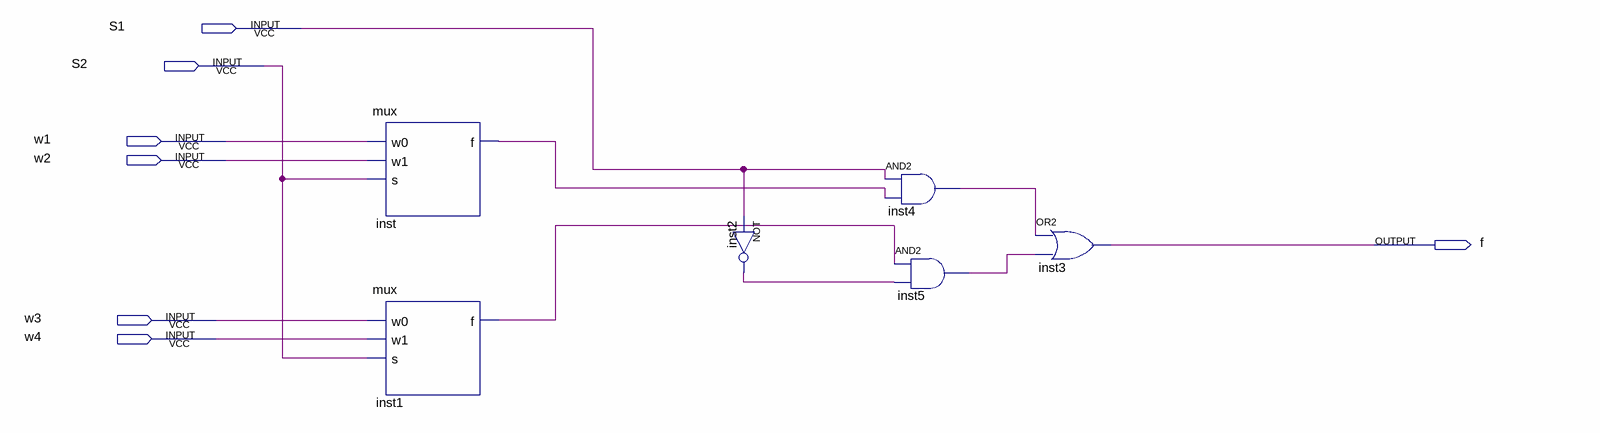
[diagram p0: schematic sheet]
// Quartus schematic muxModified.bdf as structural Verilog: 6 symbols, 7 pins
module muxModified (
  input  S1,
  input  S2,
  input  w1,
  input  w2,
  input  w3,
  input  w4,
  output f
);

  wire inst1_f, inst2_out, inst4_out, inst5_out, inst_f;

  mux inst (.w0(w1), .w1(w2), .s(S2), .f(inst_f));
  mux inst1 (.w0(w3), .w1(w4), .s(S2), .f(inst1_f));
  not inst2 (inst2_out, S1);
  and inst4 (inst4_out, S1, inst_f);
  and inst5 (inst5_out, inst1_f, inst2_out);
  or inst3 (f, inst4_out, inst5_out);
endmodule
